# EAGLE design indicator (EAGLE 9.5.1)
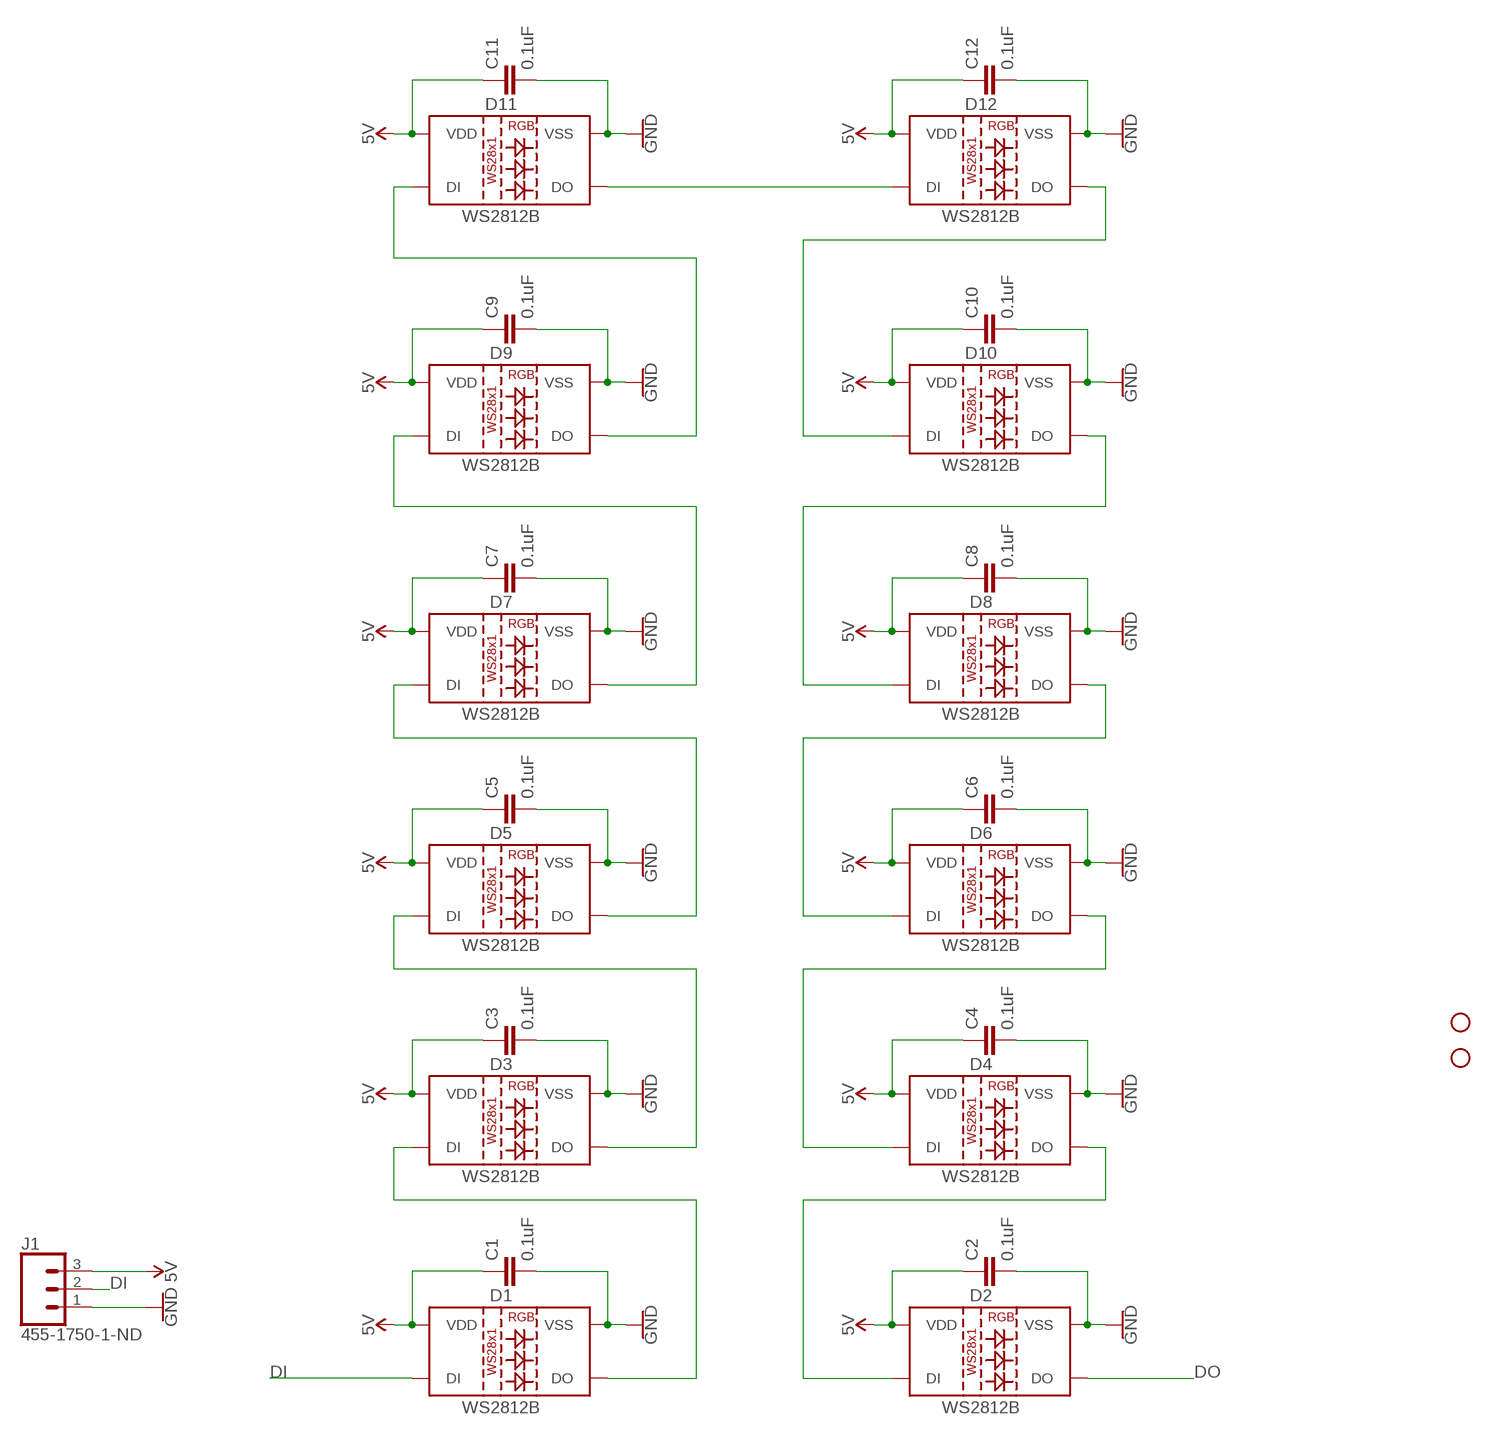
[diagram p0: schematic, sheet 1]

## Parts
C1  0.1uF  0.1UF-0603-25V-(+80/-20%)  [0603]
C2  0.1uF  0.1UF-0603-25V-(+80/-20%)  [0603]
C3  0.1uF  0.1UF-0603-25V-(+80/-20%)  [0603]
C4  0.1uF  0.1UF-0603-25V-(+80/-20%)  [0603]
C5  0.1uF  0.1UF-0603-25V-(+80/-20%)  [0603]
C6  0.1uF  0.1UF-0603-25V-(+80/-20%)  [0603]
C7  0.1uF  0.1UF-0603-25V-(+80/-20%)  [0603]
C8  0.1uF  0.1UF-0603-25V-(+80/-20%)  [0603]
C9  0.1uF  0.1UF-0603-25V-(+80/-20%)  [0603]
C10  0.1uF  0.1UF-0603-25V-(+80/-20%)  [0603]
C11  0.1uF  0.1UF-0603-25V-(+80/-20%)  [0603]
C12  0.1uF  0.1UF-0603-25V-(+80/-20%)  [0603]
D1  WS2812B  [WS2812B]
D2  WS2812B  [WS2812B]
D3  WS2812B  [WS2812B]
D4  WS2812B  [WS2812B]
D5  WS2812B  [WS2812B]
D6  WS2812B  [WS2812B]
D7  WS2812B  [WS2812B]
D8  WS2812B  [WS2812B]
D9  WS2812B  [WS2812B]
D10  WS2812B  [WS2812B]
D11  WS2812B  [WS2812B]
D12  WS2812B  [WS2812B]
H1  STAND-OFF  [STAND-OFF]
H2  STAND-OFF  [STAND-OFF]
J1  455-1750-1-ND  CONN_03  [1X03]

## Nets
5V: C1.1 C2.1 C3.1 C4.1 C5.1 C6.1 C7.1 C8.1 C9.1 C10.1 C11.1 C12.1 D1.1(VDD) D2.1(VDD) D3.1(VDD) D4.1(VDD) D5.1(VDD) D6.1(VDD) D7.1(VDD) D8.1(VDD) D9.1(VDD) D10.1(VDD) D11.1(VDD) D12.1(VDD) J1.3
DI: D1.4(DI) J1.2
DO: D2.2(DO)
GND: C1.2 C2.2 C3.2 C4.2 C5.2 C6.2 C7.2 C8.2 C9.2 C10.2 C11.2 C12.2 D1.3(VSS) D2.3(VSS) D3.3(VSS) D4.3(VSS) D5.3(VSS) D6.3(VSS) D7.3(VSS) D8.3(VSS) D9.3(VSS) D10.3(VSS) D11.3(VSS) D12.3(VSS) J1.1
N$2: D1.2(DO) D3.4(DI)
N$3: D3.2(DO) D5.4(DI)
N$4: D5.2(DO) D7.4(DI)
N$5: D7.2(DO) D9.4(DI)
N$6: D9.2(DO) D11.4(DI)
N$7: D11.2(DO) D12.4(DI)
N$8: D10.4(DI) D12.2(DO)
N$9: D8.4(DI) D10.2(DO)
N$10: D6.4(DI) D8.2(DO)
N$11: D4.4(DI) D6.2(DO)
N$12: D2.4(DI) D4.2(DO)

## Library data of the parts
C1-C12 = SparkFun-Capacitors:0.1UF: 0.1µF ceramic capacitors A capacitor is a passive two-terminal electrical component used to store electrical energy temporarily in an electric field.; PROD_ID: CAP-00810
D1-D12 = SparkFun-LED:WS2812B: WS2812B SMD addressable RGB LED 5x5mm SMD LED with built-in controller IC. Color: Red/Green/Blue mC Rating: RGB: 390, 660, 180 mcd Forward Voltage: RGB: 2.0, 3.0, 3.0 V Packages:WS2812B SparkFun Products: Blynk Board - ESP8266 <https://www.sparkfun.com/products/13794>; PROD_ID: DIO-12503
H1 H2 = SparkFun-Hardware:STAND-OFF: Stand Off Drill holes for mechanically mounting via screws, standoffs, etc. Note: Use the keepout ring to avoid running the screw head into surrounding components. Variant Overviews STAND-OFF - Mechanical footprint for a #4 phillips button head screw. STAND-OFF-TIGHT - Mechanical footprint for a #4 phillips button head screw, Example SparkFun Products Screw - Phillips Head (1/4", 4-40, 10 pack) <https://www.sparkfun.com/products/10453> (PRT-10453) Screw - Phillips Head (1/2", 4-40, 10 pack) <https://www.sparkfun.com/products/10452> (PRT-10452) Screw - Phillips Head (3/4", 4-40, 10 pack) <https://www.sparkfun.com/products/10451> (PRT-10451) Screw - Phillips Head (1", 4-40, 10 pack) <https://www.sparkfun.com/products/10450> (PRT-10450)
J1 = SparkFun-Connectors:CONN_03: Multi connection point. Often used as Generic Header-pin footprint for 0.1 inch spaced/style header connections On any of the 0.1 inch spaced packages, you can populate with these: Break Away Headers - Straight <https://www.sparkfun.com/products/116> (PRT-00116) Break Away Male Headers - Right Angle <https://www.sparkfun.com/products/553> (PRT-00553) Female Headers <https://www.sparkfun.com/products/115> (PRT-00115) Break Away Headers - Machine Pin <https://www.sparkfun.com/products/117> (PRT-00117) Break Away Female Headers - Swiss Machine Pin <https://www.sparkfun.com/products/743> (PRT-00743) Stackable Header - 3 Pin (Female, 0.1") <https://www.sparkfun.com/products/13875> (PRT-13875) For SCREWTERMINALS and SPRING TERMINALS visit here: Screw Terimnals on SparkFun.com <https://www.sparkfun.com/search/results?term=Screw+Terminals> (5mm/3.5mm/2.54mm spacing) This device is also useful as a general connection point to wire up your design to another part of your project. Our various solder wires solder well into these plated through hole pads. Hook-Up Wire - Assortment (Stranded, 22 AWG) <https://www.sparkfun.com/products/11375> (PRT-11375) Hook-Up Wire - Assortment (Solid Core, 22 AWG) <https://www.sparkfun.com/products/11367> (PRT-11367) View the entire wire category on our website here <https://www.sparkfun.com/categories/141> Special notes: Molex polarized connector foot print use with SKU : PRT-08232 with associated crimp pins and housings.; PROD_ID: XXX-00000

## Board
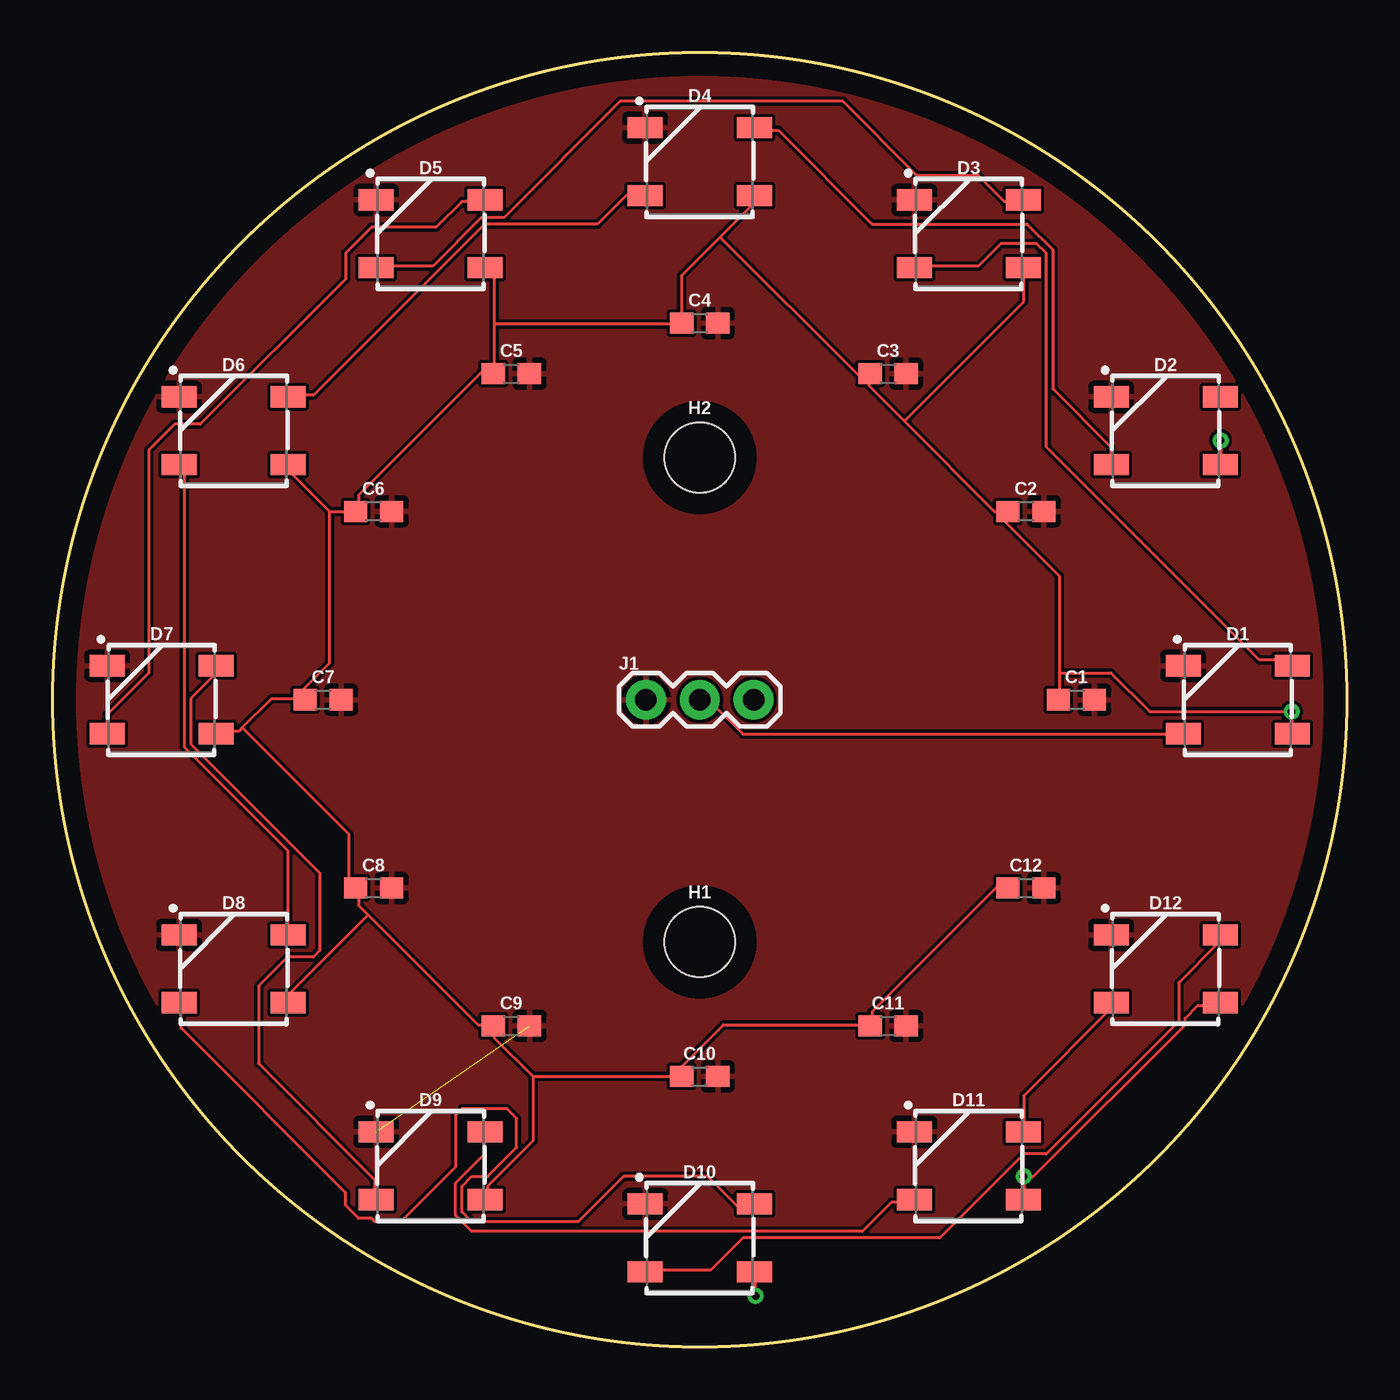
[diagram p1: board, top side]
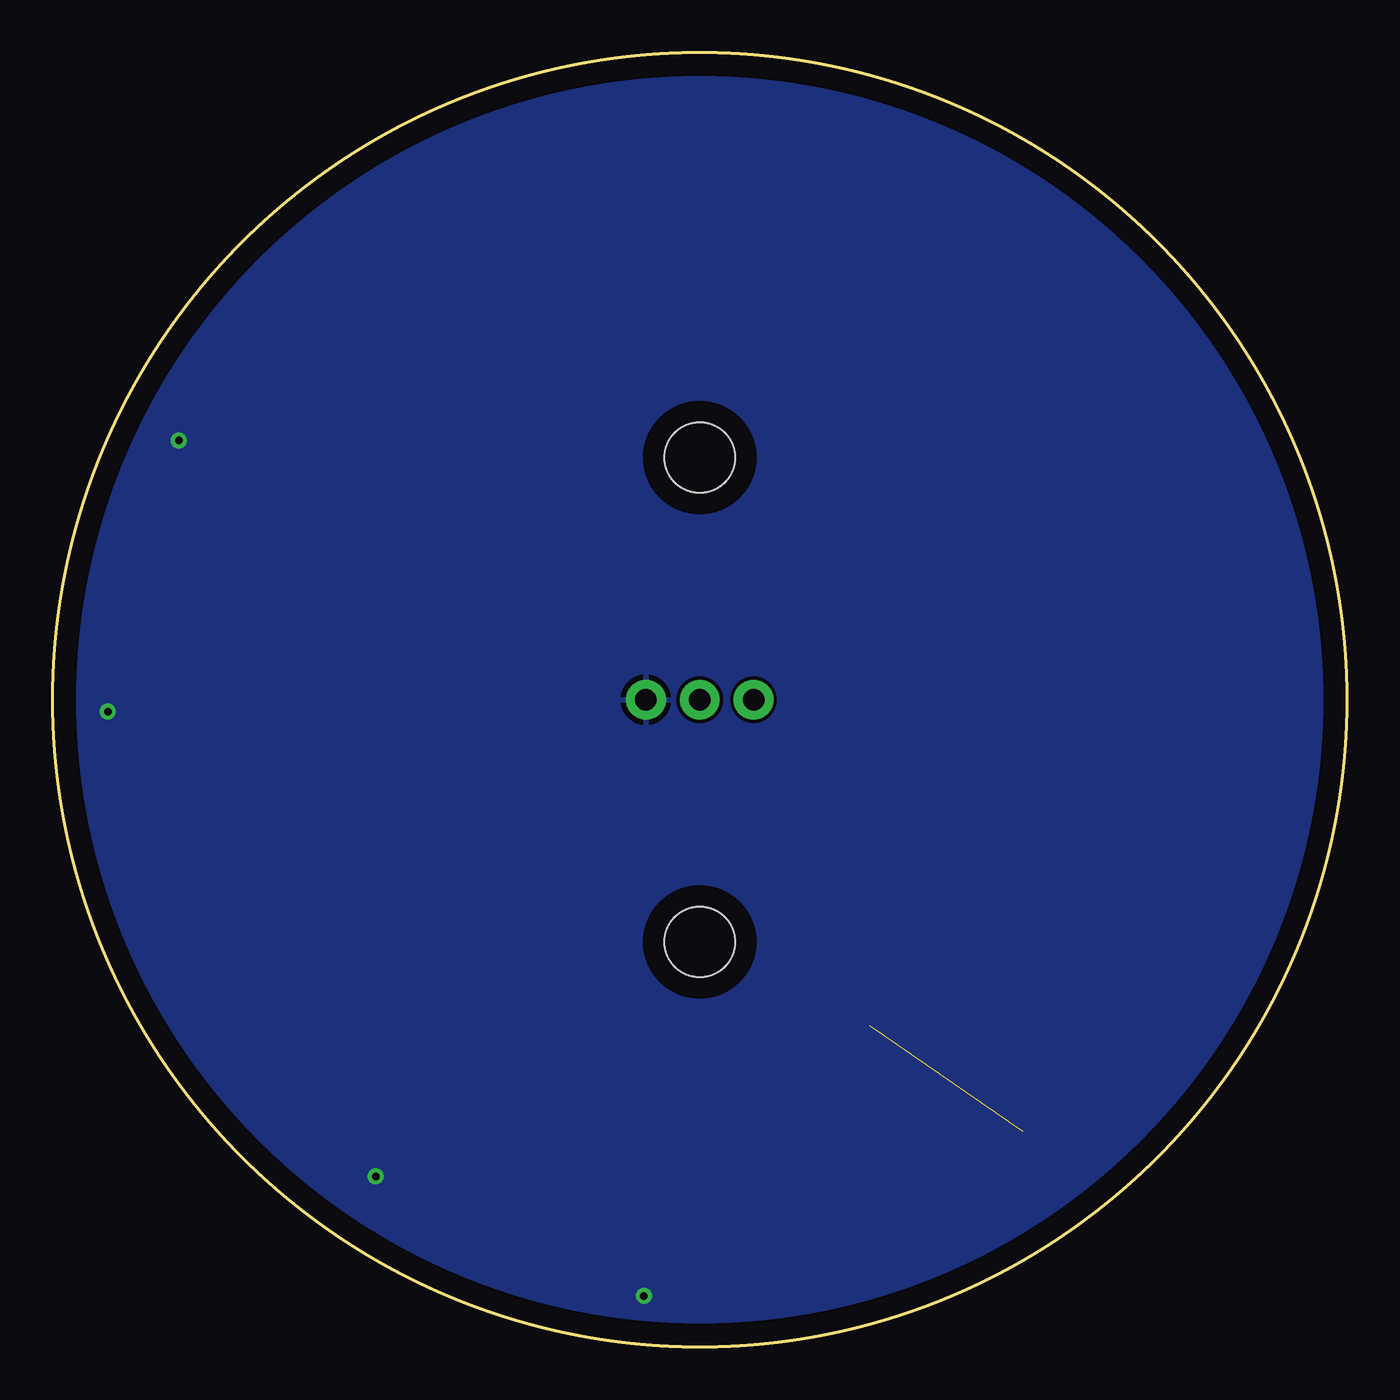
[diagram p2: board, bottom side, seen from below]

Size 61.06 x 61.06 mm. Coordinates in mm from the lower left corner, seen from the top.
Outline: circle at 30.53,30.53 radius 30.53
Copper layers (1*16): Top 0.035mm / dielectric 1.5mm / Bottom 0.035mm
Design rules "default": minimum track width 6mil, minimum drill 0.35mm, track to track 6mil, track to pad 6mil, pad to pad 6mil, via to via 6mil, smd to smd 6mil, copper to edge 40mil, drill to drill 6mil, minimum pad ring 10mil, minimum via ring 8mil, stop-mask expansion 4mil, vias tented up to drill 0mil, thermal gap 10mil

### Footprints (pad centres in the part's own frame; a part is rotated, then mirrored left to right if it is on the bottom)
0603 = smd 1.1 x 1: 1 -0.85,0; 2 0.85,0
WS2812B = smd 1.651 x 1: 1 2.577,-1.6; 2 2.577,1.6; 3 -2.577,1.6; 4 -2.577,-1.6
STAND-OFF = hole 3.302: 0,0
1X03 = drill 1.016 pad 1.88: 1 0,0; 2 2.54,0; 3 5.08,0

### Placement (x,y rotation side)
C1  48.31,30.53 0 top
C2  45.93,39.42 0 top
C3  39.42,45.93 0 top
C4  30.53,48.31 0 top
C5  21.64,45.93 0 top
C6  15.13,39.42 0 top
C7  12.75,30.53 0 top
C8  15.13,21.64 0 top
C9  21.64,15.13 0 top
C10  30.53,12.75 0 top
C11  39.42,15.13 0 top
C12  45.93,21.64 0 top
D1  55.93,30.53 0 top
D2  52.53,43.23 0 top
D3  43.23,52.53 0 top
D4  30.53,55.93 0 top
D5  17.83,52.53 0 top
D6  8.53,43.23 0 top
D7  5.13,30.53 0 top
D8  8.53,17.83 0 top
D9  17.83,8.53 0 top
D10  30.53,5.13 0 top
D11  43.23,8.53 0 top
D12  52.53,17.83 0 top
H1  30.53,19.1 0 top
H2  30.53,41.96 0 top
J1  27.99,30.53 0 top

### Tracks (layer width: path | path; a pad name or v marks a point on that pad's centre or on a via)
5V  (via drill 0.35)
  Top 0.152: v33.17,2.39 33.17,3.45 D10.1 | D11.1 45.82,6.96 v45.82,8.03 46.28,8.03 53.44,15.19 53.44,15.49 54.05,16.1 54.97,16.1 D12.1 | D1.1 58.47,29.06 v58.47,29.97 51.76,29.97 49.94,31.8 47.5,31.8 | v55.12,42.77 55.12,41.71 D2.1 | 13.06,39.42 C6.1 14.43,39.42 14.43,40.18 20.22,45.97 20.68,45.97 C5.1 20.83,45.97 20.83,48.26 | 13.06,39.42 11.23,41.25 11.23,41.55 D6.1 | 20.83,48.26 20.83,50.55 20.52,50.85 D5.1 | 31.5,52.37 33.02,53.9 33.02,54.2 D4.1 | 31.5,52.37 29.67,50.55 29.67,48.41 C4.1 29.67,48.26 20.83,48.26 | 44.91,39.42 44.45,39.42 40.18,43.69 | 44.91,39.42 C2.1 45.06,39.42 | 40.18,43.69 38.51,45.36 38.51,45.82 | 47.5,31.8 47.5,36.37 44.91,38.96 44.91,39.42 | 47.5,31.8 47.5,30.58 C1.1 | 40.18,43.69 45.82,49.33 45.82,50.85 D3.1 | 31.5,52.37 38.05,45.82 38.51,45.82 | 38.51,45.82 C3.1 | C12.1 45.06,21.74 44.6,21.74 38.66,15.8 38.66,15.19 C11.1 38.51,15.19 31.65,15.19 29.67,13.21 29.67,12.75 | 11.84,30.58 10.31,30.58 8.94,29.21 | 8.94,29.21 8.79,29.06 7.72,29.06 D7.1 | 14.88,20.37 14.43,20.83 14.43,21.59 C8.1 14.27,21.74 13.97,22.05 13.97,24.18 8.94,29.21 | 14.88,20.37 20.07,15.19 20.68,15.19 C9.1 20.83,15.04 20.83,14.58 22.66,12.75 | 22.66,12.75 29.67,12.75 | 22.66,12.75 22.66,9.7 20.52,7.57 20.52,6.96 D9.1 | 14.88,20.37 11.23,16.71 11.23,16.26 D8.1 | 29.67,12.75 C10.1 | 13.06,39.42 13.06,32.26 11.84,31.04 11.84,30.58 | 11.84,30.58 C7.1
  pour Bottom: -3.76,66.09 73.71,64.82 69.9,-3.76 -2.49,-3.76
DI
  Top 0.152: D1.4 53.29,28.9 32.56,28.9 31.04,30.43 30.58,30.43 J1.2
GND  (1 unrouted)
  pour Top: -5.03,67.36 74.98,66.09 73.71,-6.3 -8.84,-8.84
N$2
  Top 0.152: D3.4 40.79,51 43.69,51 44.75,52.07 46.43,52.07 46.89,51.61 46.89,42.47 56.95,32.41 58.32,32.41 58.47,32.26 D1.2
N$3
  Top 0.152: D5.4 15.34,51 17.93,51 20.22,53.29 21.28,53.29 26.77,58.78 37.29,58.78 40.79,55.27 43.69,55.27 44.91,54.05 45.67,54.05 D3.2
N$4
  Top 0.152: D7.4 2.54,29.06 2.54,29.82 4.52,31.8 4.52,42.32 5.74,43.54 6.96,43.54 13.82,50.39 13.82,51.61 15.04,52.83 18.08,52.83 19.3,54.05 20.37,54.05 D5.2
N$5
  Top 0.152: D9.4 15.19,6.96 15.19,7.87 9.7,13.36 9.7,17.02 11.07,18.39 12.29,18.39 12.6,18.69 12.6,22.35 6.5,28.45 6.5,30.58 7.57,31.65 7.57,32.11 D7.2
N$6
  Top 0.152: D9.2 20.37,10.01 20.37,9.09 19,7.72 19,6.2 19.76,5.44 38.2,5.44 39.57,6.81 40.64,6.81 D11.4
N$7
  Top 0.152: D11.2 45.82,10.16 45.82,11.84 50.09,16.1 D12.4
N$8
  Top 0.152: D10.4 27.99,3.61 31.04,3.61 32.56,5.13 41.86,5.13 45.82,9.09 46.89,9.09 53.14,15.34 53.14,17.17 54.97,19 54.97,19.3 D12.2
N$9
  Top 0.152: D8.4 6.04,16.1 6.04,15.04 13.82,7.26 13.82,6.65 14.43,6.04 15.04,6.04 15.19,5.89 16.41,5.89 19,8.48 19,10.92 19.3,11.23 21.44,11.23 21.89,10.77 21.89,9.4 20.52,8.03 19.76,8.03 19.3,7.57 19.3,6.35 19.76,5.89 24.79,5.89 26.92,8.03 30.89,8.03 32.26,6.65 33.02,6.65 D10.2
N$10
  Top 0.152: D8.2 11.07,19.46 11.07,23.42 6.2,28.3 6.2,41.4 6.04,41.55 D6.4
N$11
  Top 0.152: D6.2 11.23,44.91 12.29,44.91 20.37,52.98 25.7,52.98 27.08,54.36 27.84,54.36 D4.4
N$12
  Top 0.152: D2.4 49.94,41.71 49.94,42.47 47.19,45.21 47.19,51.76 45.97,52.98 38.66,52.98 34.24,57.4 33.17,57.4 D4.2